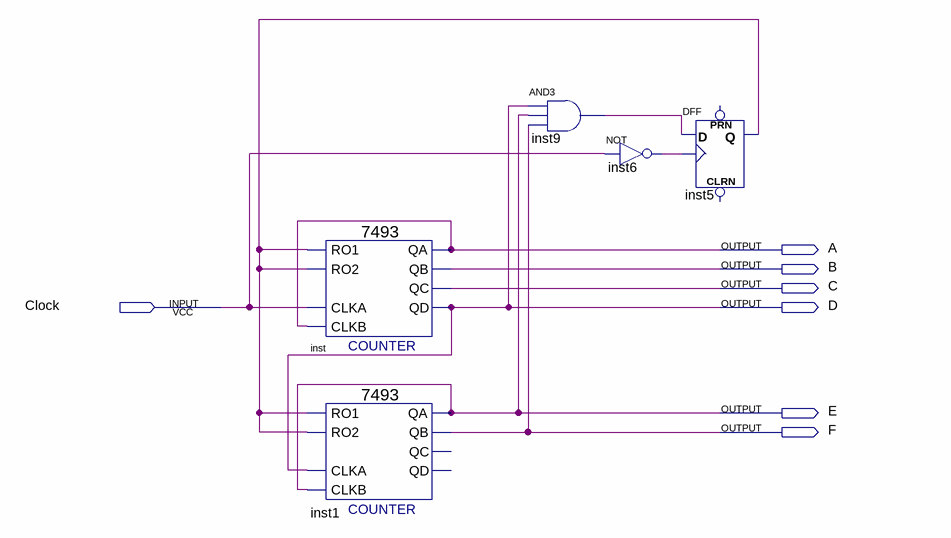
[diagram p0: schematic sheet]
// Quartus schematic 1.bdf as structural Verilog: 5 symbols, 7 pins
module \1  (
  input  Clock,
  output A,
  output B,
  output C,
  output D,
  output E,
  output F
);

  wire inst5_q, inst6_out, inst9_out;

  \7493  inst (.RO1(inst5_q), .RO2(inst5_q), .CLKA(Clock), .CLKB(A), .QC(C), .QB(B), .QA(A), .QD(D));
  \7493  inst1 (.RO1(inst5_q), .RO2(inst5_q), .CLKA(D), .CLKB(E), .QB(F), .QA(E));  // open: QC, QD
  and inst9 (inst9_out, D, E, F);
  not inst6 (inst6_out, Clock);
  DFF inst5 (.CLK(inst6_out), .D(inst9_out), .Q(inst5_q));  // open: CLRN, PRN
endmodule
